# Altium project em32f103cb.PrjPcb
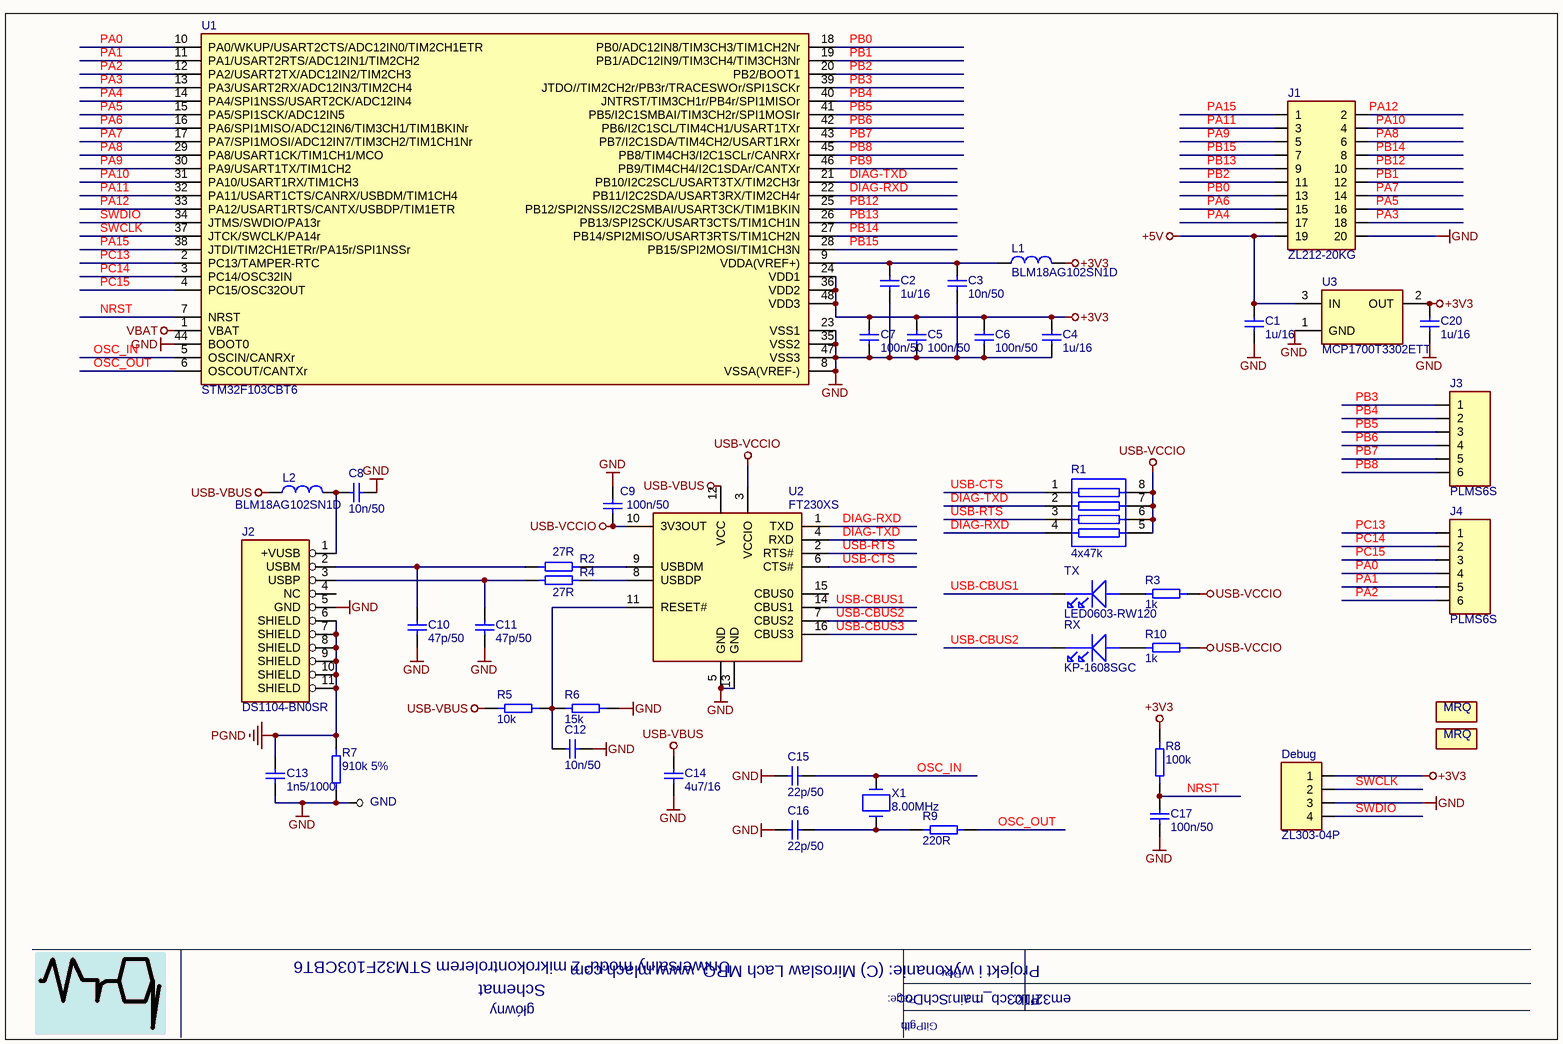
[diagram p0: em32f103cb_main.SchDoc]
NazwaProjektu: Uniwersalny modu³ z mikrokontrolerem STM32F103CBT6
1 sheet, 44 parts. Net scope: global (net labels, ports and power ports of the same name join across sheets).
Board files: em32f103cb.PcbDoc, em32f103cbf.PcbDoc

## Sheet em32f103cb_main.SchDoc
size A4; Organization: LARS Co Sp. J. K. Łagutko, A. Roman, J. Belino-Studziński; Address1: ul. Puławska 34 bud.6; Address2: 05-500 Piaseczno; Address3: telefony : (48-22) 750 66 01, 750 66 02, 750 66 03; Address4: E-mail:office@larsco.com.pl; SheetNumber: 1; SheetTotal: 1; Date: YYYY-MM-DD; CompanyName: LARS; _Wersja: -; _Wykonanie: -; _NazwaPlyty: SL_COMM_STER_v2_0; _NazwaWyrobu: Street lamp; _Rewizja: 2.0; _Konstruowal: Miroslaw Lach; _Opracowal: Miroslaw Lach; PageSetup: Record=PageOptionsŽCenterHorizontal=TrueŽCenterVertical=TrueŽPrintScale=0.97ŽXCorrection=1.00ŽYCorrection=1.00ŽPrintKind=0ŽBorderSize=5000000ŽLeftOffset=0ŽBottomOffset=0ŽOrientation=2ŽPaperLength=1000ŽPaperWidth=1000ŽScale=100ŽPaperSource=7ŽPrintQuality=-4ŽMediaType=1ŽDitherType=10ŽPaperKind=A4ŽPrintScaleMode=1; _NazwaDokumentu: SL_COMM_STER_v2_0; _RoHS: -; _Uwagi: -; Subtitle0: Schemat; Subtitle1: główny; LotOfPieces: 1

### Parts
C1  OtherParams: 1u/16  [0603-IPC]  (hidden comment: CL10B105KO8NNNC)
C2  OtherParams: 1u/16  [0603-IPC]  (hidden comment: CL10B105KO8NNNC)
C3  OtherParams: 10n/50  [0603-IPC]  (hidden comment: 06035C103KAT2A)
C4  OtherParams: 1u/16  [0603-IPC]  (hidden comment: CL10B105KO8NNNC)
C5  OtherParams: 100n/50  [0603-IPC]  (hidden comment: CL10B104JB8NNNC)
C6  OtherParams: 100n/50  [0603-IPC]  (hidden comment: CL10B104JB8NNNC)
C7  OtherParams: 100n/50  [0603-IPC]  (hidden comment: CL10B104JB8NNNC)
C8  OtherParams: 10n/50  [0603-IPC]  (hidden comment: 06035C103KAT2A)
C9  OtherParams: 100n/50  [0603-IPC]  (hidden comment: CL10B104JB8NNNC)
C10  OtherParams: 47p/50  [0603-IPC]  (hidden comment: CC0603JRNPO9BN470)
C11  OtherParams: 47p/50  [0603-IPC]  (hidden comment: CC0603JRNPO9BN470)
C12  OtherParams: 10n/50  [0603-IPC]  (hidden comment: 06035C103KAT2A)
C13  OtherParams: 1n5/1000  [1210]  (hidden comment: MCCA000836)
C14  OtherParams: 4u7/16  [0805]  (hidden comment: 0805YC475KAT2A)
C15  OtherParams: 22p/50  [0805]  (hidden comment: CL21C220JBANNNC)
C16  OtherParams: 22p/50  [0805]  (hidden comment: CL21C220JBANNNC)
C17  OtherParams: 100n/50  [0603-IPC]  (hidden comment: CL10B104JB8NNNC)
C20  OtherParams: 1u/16  [0603-IPC]  (hidden comment: CL10B105KO8NNNC)
Debug  ZL303-04P  [PLMS4S]
GND  LST1506  [LST1506]  (value not drawn)
J1  ZL212-20KG  [PLD20R]
J2  DS1104-BN0SR  [USBMS1B5]
J3  PLMS6S  [PLMS6S]
J4  PLMS6S  [PLMS6S]
L1  BLM18AG102SN1D  [0603-IPC]
L2  BLM18AG102SN1D  [0603-IPC]
LOGO1  MRQ_1_8  [MRQ_1_8]  (value not drawn)  (no BOM)
LOGO2  MRQ_1_8  [MRQ_1_8]  (value not drawn)  (no BOM)
R1  4x47k  [1206RP]
R2  OtherParams: 27R  [0603-IPC]  (hidden comment: 0603SAF270JT5E)
R3  OtherParams: 1k  [0603-IPC]  (hidden comment: 0603SAF1001T5E)
R4  OtherParams: 27R  [0603-IPC]  (hidden comment: 0603SAF270JT5E)
R5  OtherParams: 10k  [0603-IPC]  (hidden comment: 0603WGF10KT5E)
R6  OtherParams: 15k  [0603-IPC]  (hidden comment: 0603WGF15KT5E)
R7  OtherParams: 910k 5%  [2512]  (hidden comment: 25121WJ 910K T5E)
R8  OtherParams: 100k  [0805]  (hidden comment: 0805WAF 100K T5E)
R9  OtherParams: 220R  [0805]  (hidden comment: 0805WAF 220R T5E)
R10  OtherParams: 1k  [0603-IPC]  (hidden comment: 0603SAF1001T5E)
RX  KP-1608SGC  [D0603]
TX  LED0603-RW120  [D0603]
U1  STM32F103CBT6  [MS-026ABC]
U2  FT230XS  [MO-137AB]
U3  MCP1700T3302ETT  [SOT23-3]
X1  8.00MHz  [HC49SMP]

### Nets
+3V3: C4.1 C5.1 C6.1 C7.1 C20.1 Debug.1 L1.2 R8.1 U1.24(VDD1) U1.36(VDD2) U1.48(VDD3) U3.2(OUT)
+5V: C1.1 J1.19 U3.3(IN)
GND: C1.2 C2.2 C3.2 C4.2 C5.2 C6.2 C7.2 C8.1 C9.1 C10.2 C11.2 C12.1 C13.2 C14.2 C15.1 C16.1 C17.2 C20.2 Debug.3 GND.1 J1.20 J2.5(GND) R6.2 R7.2 U1.8(VSSA(VREF-)) U1.23(VSS1) U1.35(VSS2) U1.44(BOOT0) U1.47(VSS3) U2.5(GND) U2.13(GND) U3.1(GND)
PGND: C13.1 J2.6(SHIELD) J2.7(SHIELD) J2.8(SHIELD) J2.9(SHIELD) J2.10(SHIELD) J2.11(SHIELD) R7.1
USB-VBUS: C14.1 L2.2 R5.1 U2.12(VCC)
USB-VCCIO: C9.2 R1.5(R5) R1.6(R6) R1.7(R7) R1.8(R8) R3.2 R10.2 U2.3(VCCIO) U2.10(3V3OUT)
VBAT: U1.1(VBAT)
DIAG-RXD: R1.4(R4) U1.22(PB11/I2C2SDA/USART3RX/TIM2CH4r) U2.1(TXD)
DIAG-TXD: R1.2(R2) U1.21(PB10/I2C2SCL/USART3TX/TIM2CH3r) U2.4(RXD)
NRST: C17.1 R8.2 U1.7(NRST)
OSC_IN: C15.2 U1.5(OSCIN/CANRXr) X1.1
OSC_OUT: R9.2 U1.6(OSCOUT/CANTXr)
PA0: J4.4 U1.10(PA0/WKUP/USART2CTS/ADC12IN0/TIM2CH1ETR)
PA1: J4.5 U1.11(PA1/USART2RTS/ADC12IN1/TIM2CH2)
PA2: J4.6 U1.12(PA2/USART2TX/ADC12IN2/TIM2CH3)
PA3: J1.18 U1.13(PA3/USART2RX/ADC12IN3/TIM2CH4)
PA4: J1.17 U1.14(PA4/SPI1NSS/USART2CK/ADC12IN4)
PA5: J1.16 U1.15(PA5/SPI1SCK/ADC12IN5)
PA6: J1.15 U1.16(PA6/SPI1MISO/ADC12IN6/TIM3CH1/TIM1BKINr)
PA7: J1.14 U1.17(PA7/SPI1MOSI/ADC12IN7/TIM3CH2/TIM1CH1Nr)
PA8: J1.6 U1.29(PA8/USART1CK/TIM1CH1/MCO)
PA9: J1.5 U1.30(PA9/USART1TX/TIM1CH2)
PA10: J1.4 U1.31(PA10/USART1RX/TIM1CH3)
PA11: J1.3 U1.32(PA11/USART1CTS/CANRX/USBDM/TIM1CH4)
PA12: J1.2 U1.33(PA12/USART1RTS/CANTX/USBDP/TIM1ETR)
PA15: J1.1 U1.38(JTDI/TIM2CH1ETRr/PA15r/SPI1NSSr)
PB0: J1.13 U1.18(PB0/ADC12IN8/TIM3CH3/TIM1CH2Nr)
PB1: J1.12 U1.19(PB1/ADC12IN9/TIM3CH4/TIM3CH3Nr)
PB2: J1.11 U1.20(PB2/BOOT1)
PB3: J3.1 U1.39(JTDO//TIM2CH2r/PB3r/TRACESWOr/SPI1SCKr)
PB4: J3.2 U1.40(JNTRST/TIM3CH1r/PB4r/SPI1MISOr)
PB5: J3.3 U1.41(PB5/I2C1SMBAI/TIM3CH2r/SPI1MOSIr)
PB6: J3.4 U1.42(PB6/I2C1SCL/TIM4CH1/USART1TXr)
PB7: J3.5 U1.43(PB7/I2C1SDA/TIM4CH2/USART1RXr)
PB8: J3.6 U1.45(PB8/TIM4CH3/I2C1SCLr/CANRXr)
PB9: U1.46(PB9/TIM4CH4/I2C1SDAr/CANTXr)
PB12: J1.10 U1.25(PB12/SPI2NSS/I2C2SMBAI/USART3CK/TIM1BKIN)
PB13: J1.9 U1.26(PB13/SPI2SCK/USART3CTS/TIM1CH1N)
PB14: J1.8 U1.27(PB14/SPI2MISO/USART3RTS/TIM1CH2N)
PB15: J1.7 U1.28(PB15/SPI2MOSI/TIM1CH3N)
PC13: J4.1 U1.2(PC13/TAMPER-RTC)
PC14: J4.2 U1.3(PC14/OSC32IN)
PC15: J4.3 U1.4(PC15/OSC32OUT)
SWCLK: Debug.2 U1.37(JTCK/SWCLK/PA14r)
SWDIO: Debug.4 U1.34(JTMS/SWDIO/PA13r)
USB-CBUS1: TX.CATH U2.14(CBUS1)
USB-CBUS2: RX.CATH U2.7(CBUS2)
USB-CBUS3: U2.16(CBUS3)
USB-CTS: R1.1(R1) U2.6(CTS#)
USB-RTS: R1.3(R3) U2.2(RTS#)
NetC2_1: C2.1 C3.1 L1.1 U1.9(VDDA(VREF+))
NetC8_2: C8.2 J2.1(+VUSB) L2.1
NetC10_1: C10.1 J2.2(USBM) R2.1
NetC11_1: C11.1 J2.3(USBP) R4.1
NetC12_2: C12.2 R5.2 R6.1 U2.11(RESET#)
NetC16_2: C16.2 R9.1 X1.2
NetR2_2: R2.2 U2.9(USBDM)
NetR3_1: R3.1 TX.ANOD
NetR4_2: R4.2 U2.8(USBDP)
NetR10_1: R10.1 RX.ANOD

Not connected (* = marked no-connect by the designer): J2 4(NC); U2 15(CBUS0)

### Notes on the sheet
- Page:
- Rev.
- /
- Projekt i wykonanie: (C) Miroslaw Lach MRQ, www.mlach.com
- Plik:
- git:
- GitPath
- (in symbol MRQ_1_8[[/\]]MRQLOGO) MRQ

### Library data of the parts
C1 C2 C4 C20 = CL10B105KO8NNNC[[/\]]0603[[/\]]16V[[/\]]10%[[/\]]1u/16: MaxVoltage: 16V; Tolerance: 10%; Descript: capacitor 1uF, 16V, 0603, 10%, X7R; Currency5: PLN; Value: CL10B105KO8NNNC; Dimensions: 0603; Supplier5: tme.pl; Reference5: CL10B105KO8NNNC; Manufacturer5: Samsung; Typ5: CL10B105KO8NNNC; Price5: 0,02848; DateOfPrice5: 2016-02-11
C3 C8 C12 = 06035C103KAT2A[[/\]]0603[[/\]]500V[[/\]]10%[[/\]]10n/50: MaxVoltage: 500V; Tolerance: 10%; Descript: capacitor 10nF, 50V, 10%, 0603; Currency5: PLN; Value: 06035C103KAT2A; Dimensions: 0603; Supplier5: tme.pl; Reference5: 06035C103KAT2A; Manufacturer5: AVX; Typ5: 06035C103KAT2A; Price5: 0,02274; DateOfPrice5: 2016-06-02
C5-C7 C9 C17 = CL10B104JB8NNNC[[/\]]0603[[/\]]50V[[/\]]10%[[/\]]100n/50: MaxVoltage: 50V; Tolerance: 10%; Descript: capacitor 100nF, 50V, X7R, 603, 10%; Currency5: PLN; Value: CL10B104JB8NNNC; Dimensions: 0603; Supplier5: tme.pl; Reference5: CL10B104JB8NNNC; Manufacturer5: Samsung; Typ5: CL10B104JB8NNNC; Price5: 0,0213; DateOfPrice5: 2016-02-11
C10 C11 = CC0603JRNPO9BN470[[/\]]0603[[/\]]50V[[/\]]5%[[/\]]47p/50: MaxVoltage: 50V; Tolerance: 5%; Descript: capacitor 47pF, 50V NP0, 5%, 0603; Currency5: PLN; Reference5: CC0603JRNPO9470; Value: CC0603JRNPO9BN470; Dimensions: 0603; Supplier5: tme.pl; Manufacturer5: Yageo; Typ5: CC0603JRNPO9BN470; Price5: 0,0299; DateOfPrice5: 2016-01-03
C13 = MCCA000836[[/\]]1210[[/\]]1000V[[/\]]10%[[/\]]1n5/1000: MaxVoltage: 1000V; Tolerance: 10%; Descript: Capacitor 1.5nF, 1000V, 1210, X7R; Currency5: PLN; Reference5: 1855964; Value: MCCA000836; Dimensions: 1210; DateOfPrice5: 2016-02-24; Manufacturer5: MULTICOMP; Price5: 2,22; Supplier5: farnell.com; Typ5: MCCA000836
C14 = 0805YC475KAT2A[[/\]]0805[[/\]]16V[[/\]]10%[[/\]]4u7/16: MaxVoltage: 16V; Tolerance: 10%; Descript: capacitor 4.7uF,16V, X7R, 0805; Currency5: PLN; Value: 0805YC475KAT2A; Dimensions: 0805; Supplier5: tme.pl; Reference5: 0805YC475KAT2A; Manufacturer5: AVX; Typ5: 0805YC475KAT2A; Price5: 0,23225; DateOfPrice5: 2016-04-09
C15 C16 = CL21C220JBANNNC[[/\]]0805[[/\]]50V[[/\]]5%[[/\]]22p/50: MaxVoltage: 50V; Tolerance: 5%; Descript: capacitor 22pF, 50V, COG 5%, 805; Currency5: PLN; Value: CL21C220JBANNNC; Dimensions: 0805; Supplier5: tme.pl; Reference5: CL21C220JBANNNC; Manufacturer5: Samsung; Typ5: CL21C220JBANNNC; Price5: 0,02648; DateOfPrice5: 2016-06-06
Debug = ZL303-04P[[/\]]4x2mm: Descript: connector 2.00mm pitch, 4 poles, one row; Currency5: PLN; Value: ZL303-04P; Dimensions: 4x2mm; Supplier5: tme.pl; Reference5: ZL303-04P; Manufacturer5: Ninigi; Typ5: ZL303-04P; Price5: 0,23067; DateOfPrice5: 2016-06-06
GND = LST1506[[/\]]2.8x0.8: Descript: Konektor: płaski; 2,8mm; 0,8mm; męski; THT; mosiądz; srebrzony; Typ5: 60-1506-11; Currency5: PLN; Value: LST1506; Dimensions: 2.8x0.8; Supplier5: tme.pl; Reference5: LST1506; Manufacturer5: Osterrath; Price5: 0,10172; DateOfPrice5: 2016-02-24
J1 = ZL212-20KG[[/\]]2x10x2.54: Descript: Listwa kołkowa; kołkowe; męskie; PIN:20; kątowe 90°; 2,54mm; THT; Currency5: PLN; Value: ZL212-20KG; Dimensions: 2x10x2.54; Supplier5: tme.pl; Reference5: ZL212-20KG; Manufacturer5: Ninigi; Typ5: ZL212-20KG; Price5: 0,54589; DateOfPrice5: 2016-06-21
J2 = DS1104-BN0SR[[/\]]USBMS1B5: Descript: Mini USB 5 pin SMT board mount connector; Reference5: MUSB-G5P; Currency5: PLN; Replacement: tme.pl:MUSB-G5P; Value: DS1104-BN0SR; Dimensions: USBMS1B5; Supplier5: tme.pl; Manufacturer5: Connfly; Price5: 1,9716; DateOfPrice5: 2016-02-24; Typ5: DS1104-BN0SR
J3 J4 = PLMS6S[[/\]]6x2mm: Descript: connector 2.00mm pitch, 6 poles, one row; Reference5: PLMS40S-LF; Currency5: PLN; Value: PLMS6S; Dimensions: 6x2mm; Supplier5: maritex.com.pl; Price5: 0,0975; DateOfPrice5: 2012-11-02
L1 L2 = BLM18AG102SN1D[[/\]]0603[[/\]]BLM18AG102SN1D: Descript: Chip inductor SMD, 0603, Imax=0.4A,Z=1000ohm,  Rdc=0.15ohm; Currency5: PLN; Value: BLM18AG102SN1D; OtherParams: BLM18AG102SN1D; Dimensions: 0603; Supplier5: tme.pl; Reference5: BLM18AG102SN1D; Manufacturer5: Murata; Typ5: BLM18AG102SN1D; Price5: 0,07377; DateOfPrice5: 2016-06-06
LOGO1 LOGO2 = MRQ_1_8[[/\]]MRQLOGO: Value: MRQ_1_8; Dimensions: MRQLOGO
R1 = 4D03WGJ0473T[[/\]]1206RP[[/\]]0.063W[[/\]]5%[[/\]]4x47k: DissPower: 0.063W; Tolerance: 5%; Descript: THICK FILM CHIP RESISTOR ARRAY 4x47k; Reference5: DR1206-47K-4/8; Currency5: PLN; Value: 4D03WGJ0473T; OtherParams: 4x47k; Dimensions: 1206RP; Supplier5: tme.pl; Manufacturer5: Royal Ohm; Typ5: 4D03WGJ0473T; Price5: 0,02975; DateOfPrice5: 2016-02-24
R2 R4 = 0603SAF270JT5E[[/\]]0603[[/\]]0.1W[[/\]]1%[[/\]]27R: DissPower: 0.1W; Tolerance: 1%; Descript: Resistor 0603 27R, 1%; Reference5: SMD0603-27R-1%; Currency5: PLN; Value: 0603SAF270JT5E; Dimensions: 0603; Supplier5: tme.pl; Manufacturer5: Royal Ohm; Typ5: 0603SAF270JT5E; Price5: 0,02805; DateOfPrice5: 2016-01-14
R3 R10 = 0603SAF1001T5E[[/\]]0603[[/\]]0.1W[[/\]]1%[[/\]]1k: DissPower: 0.1W; Tolerance: 1%; Descript: Resistor 1kohm, 0603, 1%; Reference5: SMD0603-1K-1%; Currency5: PLN; Value: 0603SAF1001T5E; Dimensions: 0603; Supplier5: tme.pl; Manufacturer5: Royal Ohm; Typ5: 0603SAF1001T5E; Price5: 0,02511; DateOfPrice5: 2016-02-11
R5 = 0603WGF10KT5E[[/\]]0603[[/\]]0.1W[[/\]]1%[[/\]]10k: DissPower: 0.1W; Tolerance: 1%; Descript: Resistor 10kohm, 0603, 1%; Reference5: SMD0603-10K-1%; Currency5: PLN; Value: 0603WGF10KT5E; Dimensions: 0603; Supplier5: tme.pl; Manufacturer5: Royal Ohm; Typ5: 0603WGF 10K T5E; Price5: 0,02755; DateOfPrice5: 2016-06-02
R6 = 0603WGF15KT5E[[/\]]0603[[/\]]0.1W[[/\]]1%[[/\]]15k: DissPower: 0.1W; Tolerance: 1%; Descript: resistor 0603 15k, 1%; Reference5: SMD0603-15K-1%; Currency5: PLN; Value: 0603WGF15KT5E; Dimensions: 0603; Supplier5: tme.pl; Manufacturer5: Royal Ohm; Typ5: 0603WGF15KT5E; Price5: 0,029; DateOfPrice5: 2015-04-14
R7 = 25121WJ 910K T5E[[/\]]2512[[/\]]1W[[/\]]5%[[/\]]910k 5%: DissPower: 1W; Tolerance: 5%; Descript: Resistor 91kohm, 2512, 1W, 5%; Reference5: SMD2512-910K; Currency5: PLN; Value: 25121WJ 910K T5E; Dimensions: 2512; Supplier5: tme.pl; Price5: 0,09918; DateOfPrice5: 2016-02-24; Manufacturer5: Royal Ohm; Typ5: 25121WJ 910K T5E
R8 = 0805WAF 100K T5E[[/\]]0805[[/\]]0.125W[[/\]]1%[[/\]]100k: DissPower: 0.125W; Tolerance: 1%; Descript: Resistor 100kohm, 0805, 1%; Reference5: SMD0805-100K-1%; Currency5: PLN; Value: 0805WAF 100K T5E; Dimensions: 0805; Supplier5: tme.pl; Manufacturer5: Royal Ohm; Typ5: 0805WAF 100K T5E; Price5: 0,03545; DateOfPrice5: 2016-06-06
R9 = 0805WAF 220R T5E[[/\]]0805[[/\]]0.125W[[/\]]1%[[/\]]220R: DissPower: 0.125W; Tolerance: 1%; Descript: Resistor 220ohm, 0805, 1%; Reference5: SMD0805-220R-1%; Currency5: PLN; Value: 0805WAF 220R T5E; Dimensions: 0805; Supplier5: tme.pl; Manufacturer5: Royal Ohm; Typ5: 0805WAF 220R T5E; Price5: 0,03545; DateOfPrice5: 2016-06-06
RX = KP-1608SGC[[/\]]0603: Descript: LED; SMD; 0603; zielony; 4-15mcd; 120°; 1,6x0,8mm; Currency5: PLN; Value: KP-1608SGC; Dimensions: 0603; Supplier5: tme.pl; Reference5: KP-1608SGC; Manufacturer5: Kingbright Electronic; Typ5: KP-1608SGC; Price5: 0,14997; DateOfPrice5: 2016-01-14
TX = LED0603-RW120[[/\]]0603: Descript: LED red 0603, 120mcd; Currency5: PLN; Value: LED0603-RW120; Dimensions: 0603; Supplier5: maritex.com.pl; Reference5: LED0603-RW120; Typ5: LED0603-RW120; Price5: 0,095; DateOfPrice5: 2016-06-06
U1 = STM32F103CBT6[[/\]]MS-026ABC: Descript: ARM Cortex-M3 CPU, 128kB Flash, 20kB RAM, USB, CAN, 3xUART, 2xI2C, 2xSPI, ADC, STM, LQFP48, RoHS; Currency5: PLN; Value: STM32F103CBT6; Dimensions: MS-026ABC; Supplier5: tme.pl; Reference5: STM32F103CBT6; Manufacturer5: ST; Typ5: STM32F103CBT6; Price5: 18,69; DateOfPrice5: 2015-12-14
U2 = FT230XS[[/\]]MO-137AB: Descript: FT230X USB TO BASIC UART IC; Reference5: FT230XS-R; Currency5: PLN; Value: FT230XS; Dimensions: MO-137AB; Supplier5: tme.pl; Manufacturer5: FTDI; Typ5: FT230XS-R; Price5: 8,17; DateOfPrice5: 2016-01-14
U3 = MCP1700T3302ETT[[/\]]SOT23-3: Descript: Low quiescent current LDO, 3.3V, 250mA, SOT-23; Typ5: MCP1700T3302E/TT; Currency5: PLN; Value: MCP1700T3302ETT; Dimensions: SOT23-3; Supplier5: tme.pl; Reference5: MCP1700T3302ETT; Manufacturer5: Microchip; Price5: 1,4272; DateOfPrice5: 2015-11-20
X1 = 8.00MHz[[/\]]HC49/4HSMX[[/\]]8.00MHz: Descript: crystal 8MHz, 1; Reference5: 8.00M-SMDHC49S; Currency5: PLN; Value: 8.00MHz; OtherParams: 8.00MHz; Dimensions: HC49/4HSMX; Supplier5: tme.pl; Manufacturer5: YIC; Price5: 1,5242; DateOfPrice5: 2016-06-06